# EAGLE design PICKIT4-adaptorUPDI (EAGLE 7.7.0)
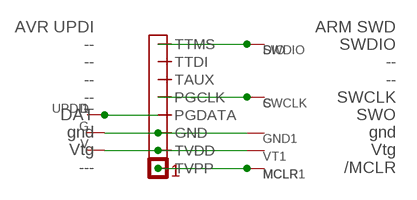
[diagram p0: schematic, sheet 1]

## Parts
C  WIRER  [GENERIC-RD-1]
D  WIRER  [GENERIC-RD-1]
DIO  WIRER  [GENERIC-RD-1]
G  WIRER  [GENERIC-RD-1]
GND1  WIRE-R12  [VIA12]
MCLR  WIRE-R12  [VIA12]
MCLR1  WIRER  [GENERIC-RD-1]
SWCLK  WIRE-R12  [VIA12]
SWDIO  WIRE-R12  [VIA12]
U$1  PICKIT4PINHDR  [PINHEAD1X8]
UPDI1  WIRE-R12  [VIA12]
V  WIRER  [GENERIC-RD-1]
VT1  WIRE-R12  [VIA12]

## Nets
GND: G.P$1 GND1.P$1 U$1.P$3(GND)
N$2: U$1.P$2(TVDD) V.P$1 VT1.P$1
N$4: D.P$1 U$1.P$4(PGDATA) UPDI1.P$1
N$5: C.P$1 SWCLK.P$1 U$1.P$5(PGCLK)
TTMS: DIO.P$1 SWDIO.P$1 U$1.P$8(TTMS)
TVPP: MCLR1.P$1 MCLR.P$1 U$1.P$1(TVPP)
Unconnected: U$1.P$6(TAUX) U$1.P$7(TTDI)

## Library data of the parts
C D DIO G GND1 MCLR MCLR1 SWCLK SWDIO UPDI1 V VT1 = mylib4:WIRE: Pad for a wire offboard
U$1 = mylib4:PICKIT4: PICKIT 4 Programming connector Handles PICx, ARM SWD, AVR ISP, UPDI, PDI, TPI, an JTAG/EJTAG

## Net classes
0 default: width 0.4 mm, drill 0.6 mm, clearance 0.152 mm
1 power: width 0.8 mm, drill 0.7 mm, clearance 0.152 mm
2 clock: width 0.25 mm, drill 0.6 mm, clearance 0.152 mm

## Board
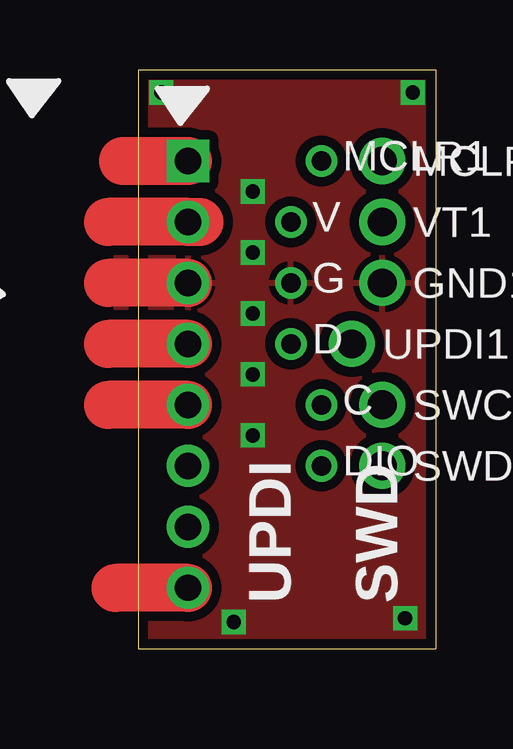
[diagram p1: board, top side]
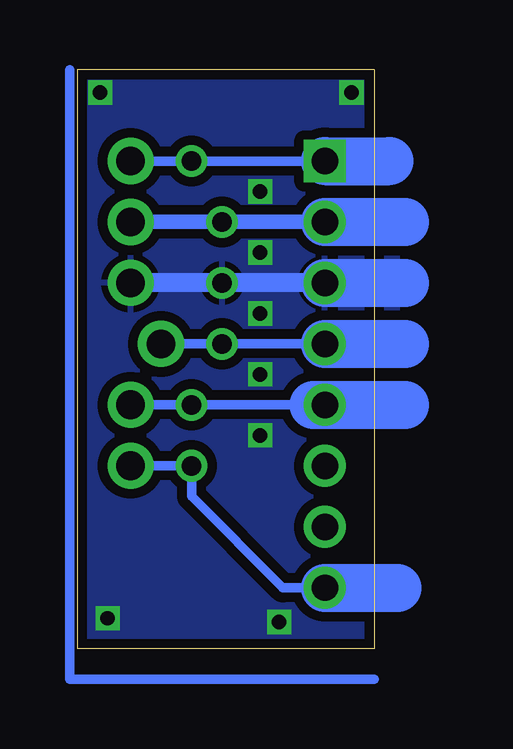
[diagram p2: board, bottom side, seen from below]

Size 12.38 x 24.13 mm. Coordinates in mm from the lower left corner, seen from the top.
Outline: 0,0 12.38,0 12.38,24.13 0,24.13 0,0
Copper layers (1*16): Top 0.035mm / dielectric 1.5mm / Bottom 0.035mm
Design rules "default *": minimum track width 10mil, minimum drill 24mil, track to track 6mil, track to pad 6mil, pad to pad 8mil, via to via 8mil, smd to smd 8mil, copper to edge 16mil, drill to drill 8mil, minimum pad ring 10mil, minimum via ring 8mil, stop-mask expansion 4mil, vias tented up to drill 0.65mm, thermal gap 10mil

### Footprints (pad centres in the part's own frame; a part is rotated, then mirrored left to right if it is on the bottom)
GENERIC-RD-1 = drill 0.813: P$1 0,0
VIA12 = drill 1.2: P$1 0,0
PINHEAD1X8 = drill 1.1 square: P$1 0,8.89 | drill 1.1: P$2 0,6.35; P$3 0,3.81; P$4 0,1.27; P$5 0,-1.27; P$6 0,-3.81; P$7 0,-6.35; P$8 0,-8.89

### Placement (x,y rotation side)
C  7.62,10.16 0 top
D  6.35,12.7 0 top
DIO  7.62,7.62 0 top
G  6.35,15.24 0 top
GND1  10.16,15.24 0 top
MCLR  10.16,20.32 0 top
MCLR1  7.62,20.32 0 top
SWCLK  10.16,10.16 0 top
SWDIO  10.16,7.62 0 top
U$1  2.06,11.43 0 top
UPDI1  8.89,12.7 0 top
V  6.35,17.78 0 top
VT1  10.16,17.78 0 top

### Tracks (layer width: path | path; a pad name or v marks a point on that pad's centre or on a via)
GND  (via drill 0.6)
  Top 2: U$1.P$3 -1.27,15.24
  Bottom 0.8: U$1.P$3 G.P$1 GND1.P$1
  Bottom 2: U$1.P$3 -1.27,15.24
  other vias: 0.95,23.18 11.43,23.18 11.11,1.27 4.76,8.89 4.76,11.43 3.97,1.11 4.76,13.97 4.76,16.51 4.76,19.05
  pour Top (isolate 0.4): -0.95,24.77 -0.95,-2.22 13.02,-2.22 13.02,24.77
  pour Bottom (isolate 0.4): -0.95,25.16 -0.95,-1.91 12.78,-1.98 12.78,25.32
N$1
  Bottom 0.4: 0,-1.27 12.7,-1.27 12.7,24.13
N$2
  Top 2: 2.54,17.78 U$1.P$2 -1.27,17.78
  Bottom 0.6: U$1.P$2 V.P$1 VT1.P$1
  Bottom 2: U$1.P$2 -1.27,17.78
N$4
  Top 2: U$1.P$4 -1.27,12.7
  Bottom 0.4: U$1.P$4 D.P$1 UPDI1.P$1
  Bottom 2: U$1.P$4 -1.27,12.7
N$5
  Top 2: U$1.P$5 -1.27,10.16
  Bottom 0.4: U$1.P$5 2.54,10.16 C.P$1 SWCLK.P$1
  Bottom 2: 2.54,10.16 -1.27,10.16
TTMS
  Top 2: U$1.P$8 -0.95,2.54
  Bottom 0.4: U$1.P$8 3.81,2.54 7.62,6.35 DIO.P$1 SWDIO.P$1
  Bottom 2: U$1.P$8 -0.95,2.54
TVPP
  Top 2: U$1.P$1 -0.64,20.32
  Bottom 0.4: U$1.P$1 MCLR1.P$1 MCLR.P$1
  Bottom 2: U$1.P$1 -0.64,20.32

### Text on the board
tPlace: UPDI | SWD
_tSilk: MCLR | V | G | D | C | PICKit4/SNAP | DIO | UPDI | SWD
_bplace: MCLR | V | G | D | C | PICKit4 or SNAP | DIO | UPDI | SWD